# Altium schematic sheet buffer.SchDoc
size A4
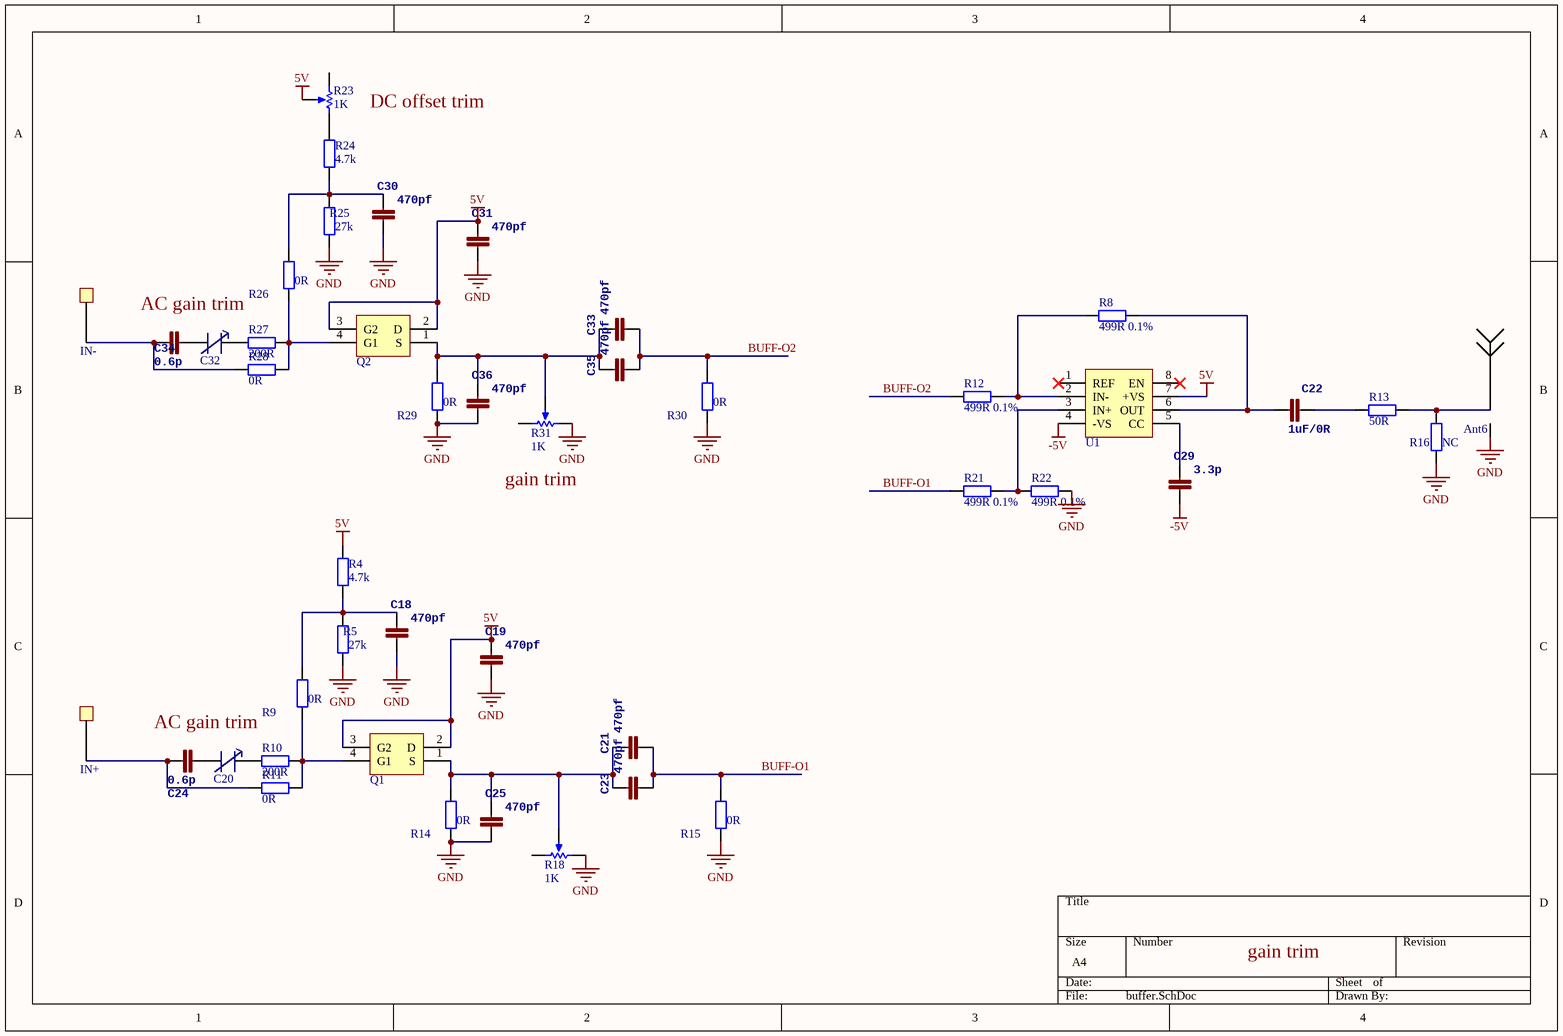
[diagram p0: buffer.SchDoc]

## Parts
Ant6  Antenna  [SMA-HOLE]  (value not drawn)
C18  470pf  [0402]
C19  470pf  [0805]
C20  TZY2R200AC01R00  [TRIM_C]  (value not drawn)
C21  470pf  [0402]
C22  1uF/0R  [0402]
C23  470pf  [0402]
C24  0.6p  [0402]
C25  470pf  [0402]
C29  3.3p  [0402]
C30  470pf  [0402]
C31  470pf  [0805]
C32  TZY2R200AC01R00  [TRIM_C]  (value not drawn)
C33  470pf  [0402]
C34  0.6p  [0402]
C35  470pf  [0402]
C36  470pf  [0402]
IN+  TestPad  [TestPad]  (value not drawn)
IN-  TestPad  [TestPad]  (value not drawn)
Q1  BF998  [SOT143]  (value not drawn)
Q2  BF998  [SOT143]  (value not drawn)
R4  4.7k  [0402]
R5  27k  [0402]
R8  499R 0.1%  [0402]
R9  0R  [0402]
R10  200R  [0402]
R11  0R  [0402]
R12  499R 0.1%  [0402]
R13  50R  [0402]
R14  0R  [0402]
R15  0R  [0402]
R16  NC  [0402]
R18  value 1K  [POT1]  (hidden comment: RPot)
R21  499R 0.1%  [0402]
R22  499R 0.1%  [0402]
R23  value 1K  [POT1]  (hidden comment: RPot)
R24  4.7k  [0402]
R25  27k  [0402]
R26  0R  [0402]
R27  200R  [0402]
R28  0R  [0402]
R29  0R  [0402]
R30  0R  [0402]
R31  value 1K  [POT1]  (hidden comment: RPot)
U1  AD8021  [SO8]  (value not drawn)

## Nets
5V: C19.2 C31.2 Q1.2(D) Q1.3(G2) Q2.2(D) Q2.3(G2) R4.2 R23.3(TAP) U1.7(+VS)
-5V: C29.1 U1.4(-VS)
GND: Ant6.GND(G) C18.1 C19.1 C25.1 C30.1 C31.1 C36.1 R5.2 R14.2 R15.2 R16.2 R18.1(TOP) R22.1 R25.2 R29.2 R30.2 R31.1(TOP)
BUFF-O1: C21.1 C23.1 R15.1 R21.1
BUFF-O2: C33.1 C35.1 R12.1 R30.1
NetAnt6_1: Ant6.1 R13.2 R16.1
NetC18_2: C18.2 R4.1 R5.1 R9.1
NetC20_1: C20.1 C24.1
NetC20_2: C20.2 R10.1
NetC21_2: C21.2 C23.2 C25.2 Q1.1(S) R14.1 R18.3(TAP)
NetC22_1: C22.1 R13.1
NetC22_2: C22.2 R8.2 U1.6(OUT)
NetC24_2: C24.2 IN+.1 R11.1
NetC29_2: C29.2 U1.5(CC)
NetC30_2: C30.2 R24.1 R25.1 R26.1
NetC32_1: C32.1 C34.1
NetC32_2: C32.2 R27.1
NetC33_2: C33.2 C35.2 C36.2 Q2.1(S) R29.1 R31.3(TAP)
NetC34_2: C34.2 IN-.1 R28.1
NetQ1_4: Q1.4(G1) R9.2 R10.2 R11.2
NetQ2_4: Q2.4(G1) R26.2 R27.2 R28.2
NetR8_1: R8.1 R12.2 U1.2(IN-)
NetR21_2: R21.2 R22.2 U1.3(IN+)
NetR23_2: R23.2(BOT) R24.2

Not connected (* = marked no-connect by the designer): R18 2(BOT); R23 1(TOP); R31 2(BOT); U1 1(REF)* 8(EN)*

## Notes on the sheet
- DC offset trim
- AC gain trim
- gain trim

## Library data of the parts
C18 C19 C21-C25 C29-C31 C33-C36 = CAP0402-CAP: <b>Capacitor</b> / Standard 0603 ceramic capacitor, and 0.1" leaded capacitor.; PARTNO: CC0402ZRY5V7BB104
C20 C32 = TRIM_C
R4 R5 R8-R16 R21 R22 R24-R30 = Res2: Resistor; Published: 8-Jun-2000; LatestRevisionDate: 17-Jul-2002; LatestRevisionNote: Re-released for DXP Platform.; PackageReference: AXIAL-0.4; Publisher: Altium Limited; PackageDescription: Axial Device, Thru-Hole; 2 Leads; 0.4 in Pin Spacing
R18 R23 R31 = RPot: Potentiometer; Sim Note: Enter the Resistance value and the set point into parameter fields.; Set Position: 0.5; Published: 8-Jun-2000; LatestRevisionDate: 17-Jul-2002; LatestRevisionNote: Re-released for DXP Platform.; PackageReference: VR5; Publisher: Altium Limited; PackageDescription: Variable Resistor, Thru-Hole; 3 Leads